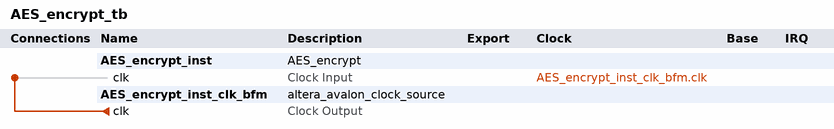
[diagram p0: system contents]
# Platform Designer (Qsys) system AES_encrypt_tb, Cyclone V 5CSXFC6D6F31C6
# Parameters at their usual value, and those the tool derives, are not listed.
package require -exact qsys 24.1
create_system AES_encrypt_tb
set_project_property DEVICE_FAMILY {Cyclone V}
set_project_property DEVICE 5CSXFC6D6F31C6

add_instance AES_encrypt_inst AES_encrypt 1.0

add_instance AES_encrypt_inst_clk_bfm altera_avalon_clock_source 24.1

# connections
add_connection AES_encrypt_inst_clk_bfm.clk AES_encrypt_inst.clk clock

set_interconnect_requirement {$system} qsys_mm.clockCrossingAdapter HANDSHAKE
set_interconnect_requirement {$system} qsys_mm.enableEccProtection FALSE
set_interconnect_requirement {$system} qsys_mm.insertDefaultSlave FALSE
set_interconnect_requirement {$system} qsys_mm.maxAdditionalLatency 1

save_system AES_encrypt_tb.qsys
